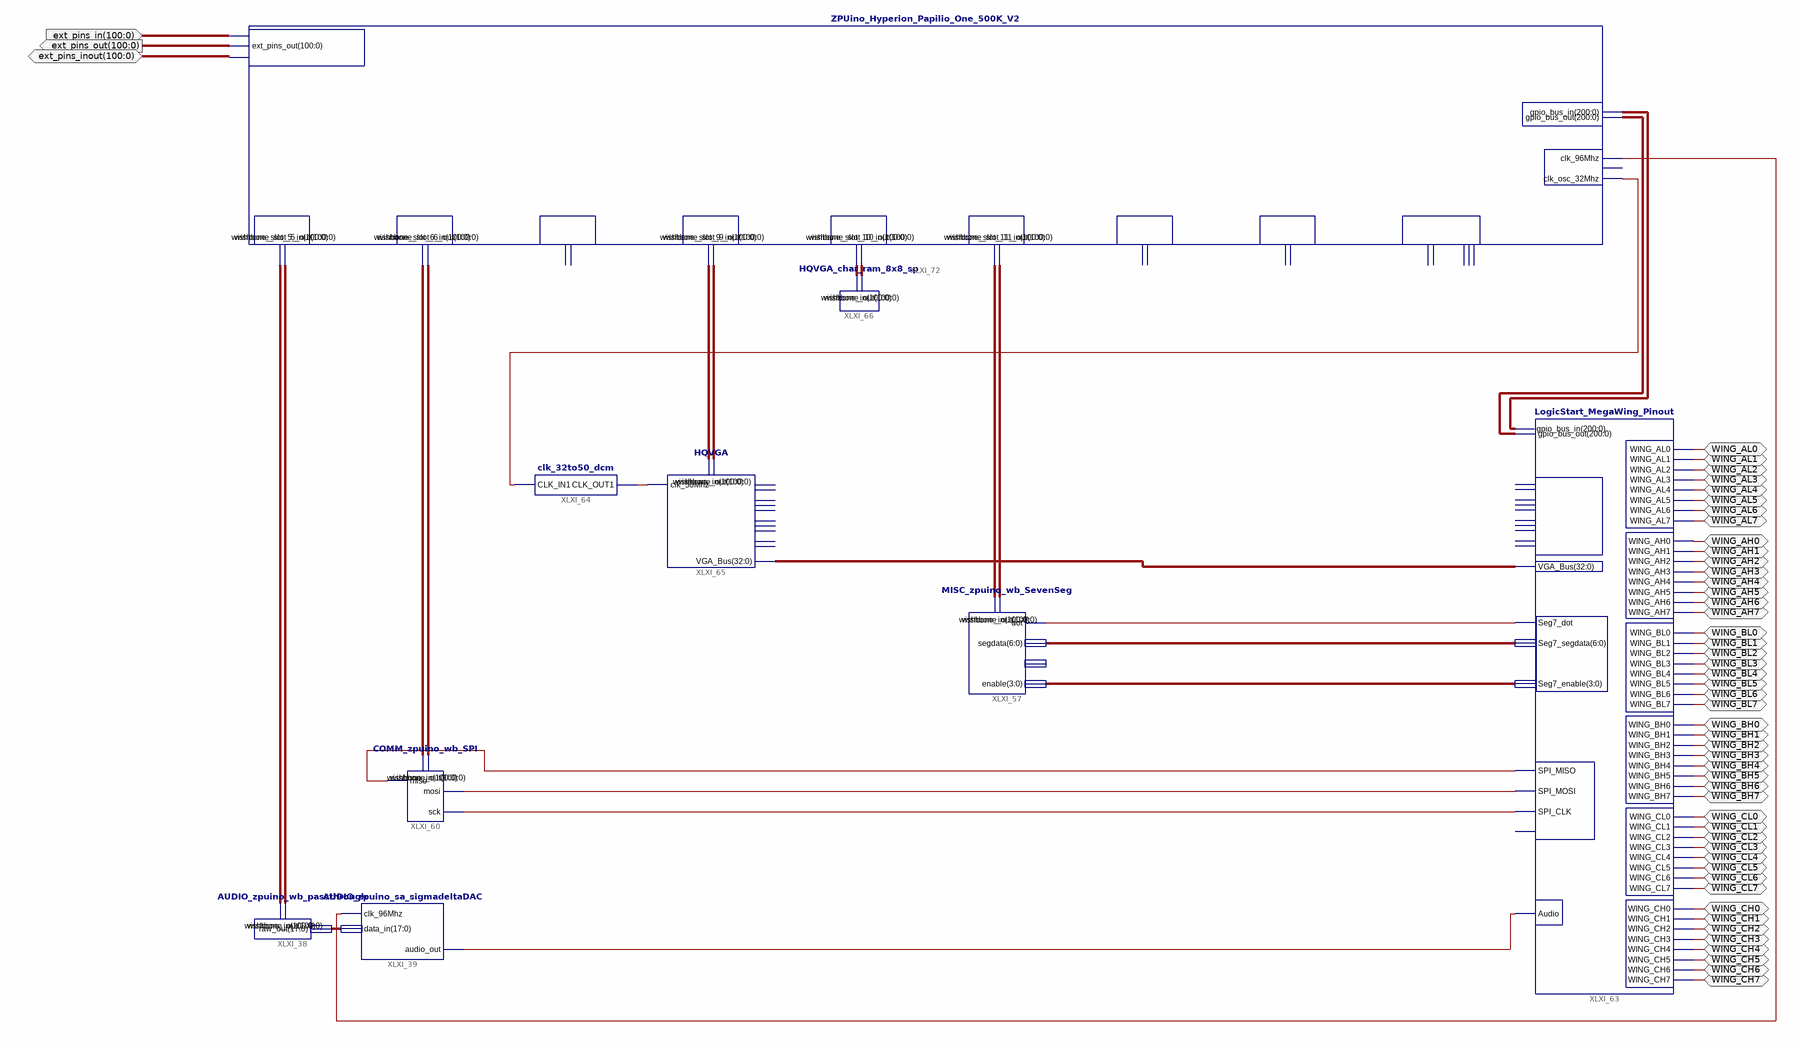
[diagram p0: schematic sheet 1]
// Xilinx ISE schematic Papilio_One_500K.sch (spartan3e) as structural Verilog: 9 symbols, 51 ports
module Papilio_One_500K (
  input  [100:0] ext_pins_in,
  inout  WING_CH7,
  inout  WING_CH6,
  inout  WING_CH5,
  inout  WING_CH4,
  inout  WING_CH3,
  inout  WING_CH2,
  inout  WING_CH1,
  inout  WING_CH0,
  inout  WING_CL7,
  inout  WING_CL6,
  inout  WING_CL5,
  inout  WING_CL4,
  inout  WING_CL3,
  inout  WING_CL2,
  inout  WING_CL1,
  inout  WING_CL0,
  inout  WING_BH7,
  inout  WING_BH6,
  inout  WING_BH5,
  inout  WING_BH4,
  inout  WING_BH3,
  inout  WING_BH2,
  inout  WING_BH1,
  inout  WING_BH0,
  inout  WING_BL7,
  inout  WING_BL6,
  inout  WING_BL5,
  inout  WING_BL4,
  inout  WING_BL3,
  inout  WING_BL2,
  inout  WING_BL1,
  inout  WING_BL0,
  inout  WING_AH7,
  inout  WING_AH6,
  inout  WING_AH5,
  inout  WING_AH4,
  inout  WING_AH3,
  inout  WING_AH2,
  inout  WING_AH1,
  inout  WING_AH0,
  inout  WING_AL7,
  inout  WING_AL6,
  inout  WING_AL5,
  inout  WING_AL4,
  inout  WING_AL3,
  inout  WING_AL2,
  inout  WING_AL1,
  inout  WING_AL0,
  inout  [100:0] ext_pins_inout,
  output [100:0] ext_pins_out
);

  wire XLXN_452, XLXN_544, XLXN_549, XLXN_596, XLXN_603, XLXN_604, XLXN_605, XLXN_610;
  wire [3:0] XLXN_543;
  wire [6:0] XLXN_542;
  wire [17:0] XLXN_450;
  wire [32:0] XLXN_621;
  wire [100:0] XLXN_611, XLXN_612, XLXN_613, XLXN_614, XLXN_615, XLXN_616, XLXN_617, XLXN_618, XLXN_619,
       XLXN_620;
  wire [200:0] XLXN_408, XLXN_409;

  LogicStart_MegaWing_Pinout XLXI_63 (
    .gpio_bus_out(XLXN_408), .gpio_bus_in(XLXN_409), .WING_AL0(WING_AL0), .WING_AL1(WING_AL1),
    .WING_AL2(WING_AL2), .WING_AL3(WING_AL3), .WING_AL4(WING_AL4), .WING_AL5(WING_AL5), .WING_AL6(WING_AL6),
    .WING_AL7(WING_AL7), .WING_AH0(WING_AH0), .WING_AH1(WING_AH1), .WING_AH2(WING_AH2), .WING_AH3(WING_AH3),
    .WING_AH4(WING_AH4), .WING_AH5(WING_AH5), .WING_AH6(WING_AH6), .WING_AH7(WING_AH7), .WING_BL0(WING_BL0),
    .WING_BL1(WING_BL1), .WING_BL2(WING_BL2), .WING_BL3(WING_BL3), .WING_BL4(WING_BL4), .WING_BL5(WING_BL5),
    .WING_BL6(WING_BL6), .WING_BL7(WING_BL7), .WING_BH0(WING_BH0), .WING_BH1(WING_BH1), .WING_BH2(WING_BH2),
    .WING_BH3(WING_BH3), .WING_BH4(WING_BH4), .WING_BH5(WING_BH5), .WING_BH6(WING_BH6), .WING_BH7(WING_BH7),
    .WING_CL0(WING_CL0), .WING_CL1(WING_CL1), .WING_CL2(WING_CL2), .WING_CL3(WING_CL3), .WING_CL4(WING_CL4),
    .WING_CL5(WING_CL5), .WING_CL6(WING_CL6), .WING_CL7(WING_CL7), .WING_CH0(WING_CH0), .WING_CH1(WING_CH1),
    .WING_CH2(WING_CH2), .WING_CH3(WING_CH3), .WING_CH4(WING_CH4), .WING_CH5(WING_CH5), .WING_CH6(WING_CH6),
    .WING_CH7(WING_CH7), .Audio(XLXN_610), .SPI_MISO(XLXN_605), .SPI_MOSI(XLXN_604), .SPI_CLK(XLXN_603),
    .Seg7_dot(XLXN_544), .Seg7_enable(XLXN_543), .Seg7_segdata(XLXN_542), .VGA_Bus(XLXN_621));  // open: SPI_CS, VGA_Red2, VGA_Red1, VGA_Red0, VGA_Green2, VGA_Green1, VGA_Green0, VGA_Hsync, VGA_Vsync, VGA_Blue1, VGA_Blue0
  MISC_zpuino_wb_SevenSeg XLXI_57 (
    .segdata(XLXN_542), .enable(XLXN_543), .dot(XLXN_544), .wishbone_in(XLXN_615), .wishbone_out(XLXN_616));  // open: extra
  COMM_zpuino_wb_SPI XLXI_60 (
    .miso(XLXN_605), .sck(XLXN_603), .mosi(XLXN_604), .wishbone_in(XLXN_613), .wishbone_out(XLXN_614));
  AUDIO_zpuino_wb_passthrough XLXI_38 (.raw_out(XLXN_450), .wishbone_in(XLXN_611), .wishbone_out(XLXN_612));
  AUDIO_zpuino_sa_sigmadeltaDAC XLXI_39 (.data_in(XLXN_450), .audio_out(XLXN_610), .clk_96Mhz(XLXN_452));
  clk_32to50_dcm XLXI_64 (.CLK_IN1(XLXN_549), .CLK_OUT1(XLXN_596));
  HQVGA XLXI_65 (
    .clk_50Mhz(XLXN_596), .wishbone_in(XLXN_619), .wishbone_out(XLXN_620), .VGA_Bus(XLXN_621));  // open: vga_hsync, vga_vsync, vga_r2, vga_r1, vga_r0, vga_g2, vga_g1, vga_g0, vga_b1, vga_b0
  HQVGA_char_ram_8x8_sp XLXI_66 (.wishbone_in(XLXN_617), .wishbone_out(XLXN_618));
  ZPUino_Hyperion_Papilio_One_500K_V2 XLXI_72 (
    .clk_96Mhz(XLXN_452), .clk_osc_32Mhz(XLXN_549), .ext_pins_in(ext_pins_in), .ext_pins_out(ext_pins_out),
    .ext_pins_inout(ext_pins_inout), .gpio_bus_out(XLXN_408), .gpio_bus_in(XLXN_409),
    .wishbone_slot_5_out(XLXN_612), .wishbone_slot_5_in(XLXN_611), .wishbone_slot_6_in(XLXN_613),
    .wishbone_slot_6_out(XLXN_614), .wishbone_slot_9_in(XLXN_619), .wishbone_slot_9_out(XLXN_620),
    .wishbone_slot_10_in(XLXN_617), .wishbone_slot_10_out(XLXN_618), .wishbone_slot_11_in(XLXN_615),
    .wishbone_slot_11_out(XLXN_616));  // open: clk_1Mhz, wishbone_slot_8_in, wishbone_slot_8_out, wishbone_slot_12_in, wishbone_slot_12_out, wishbone_slot_13_in, wishbone_slot_13_out, wishbone_slot_14_in, wishbone_slot_14_out, wishbone_slot_video_in, wishbone_slot_video_out, vgaclkout
endmodule
